# EAGLE design atmega embedded main 2 (EAGLE 8.5.0)
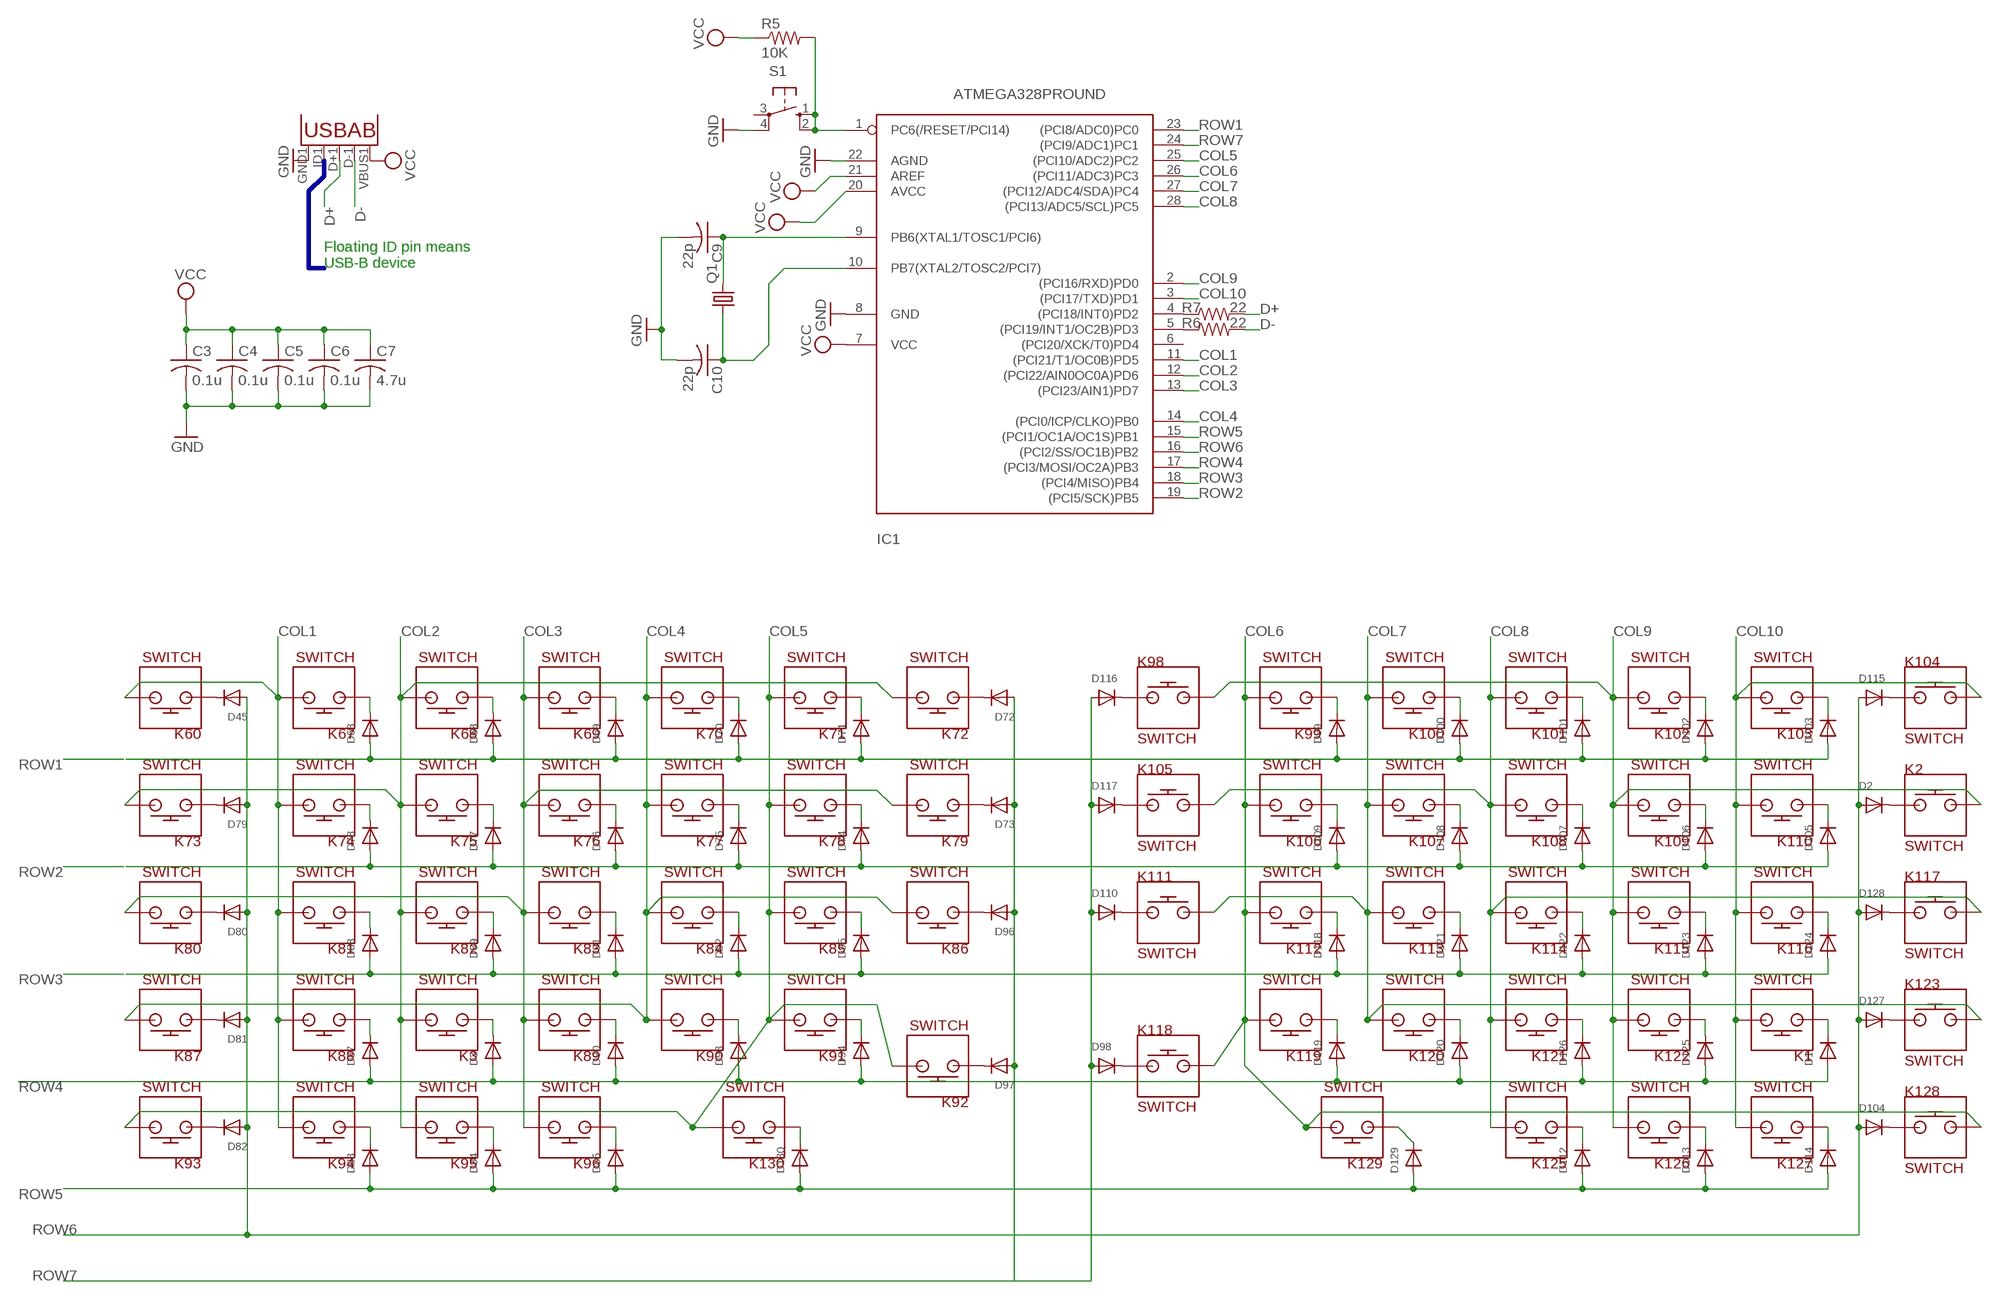
[diagram p0: schematic, sheet 1]

## Parts
C3  0.1u  C-USC0805  [C0805]
C4  0.1u  C-USC0805  [C0805]
C5  0.1u  C-USC0805  [C0805]
C6  0.1u  C-USC0805  [C0805]
C7  4.7u  C-USC0805  [C0805]
C9  22p  C-USC0805  [C0805]
C10  22p  C-USC0805  [C0805]
D1  DIODESMA  [SMADIODE]
D2  DIODESMA  [SMADIODE]
D3  DIODESMA  [SMADIODE]
D45  DIODESMA  [SMADIODE]
D63  DIODESMA  [SMADIODE]
D68  DIODESMA  [SMADIODE]
D69  DIODESMA  [SMADIODE]
D70  DIODESMA  [SMADIODE]
D71  DIODESMA  [SMADIODE]
D72  DIODESMA  [SMADIODE]
D73  DIODESMA  [SMADIODE]
D74  DIODESMA  [SMADIODE]
D75  DIODESMA  [SMADIODE]
D76  DIODESMA  [SMADIODE]
D77  DIODESMA  [SMADIODE]
D78  DIODESMA  [SMADIODE]
D79  DIODESMA  [SMADIODE]
D80  DIODESMA  [SMADIODE]
D81  DIODESMA  [SMADIODE]
D82  DIODESMA  [SMADIODE]
D83  DIODESMA  [SMADIODE]
D84  DIODESMA  [SMADIODE]
D85  DIODESMA  [SMADIODE]
D87  DIODESMA  [SMADIODE]
D88  DIODESMA  [SMADIODE]
D89  DIODESMA  [SMADIODE]
D90  DIODESMA  [SMADIODE]
D91  DIODESMA  [SMADIODE]
D92  DIODESMA  [SMADIODE]
D93  DIODESMA  [SMADIODE]
D94  DIODESMA  [SMADIODE]
D95  DIODESMA  [SMADIODE]
D96  DIODESMA  [SMADIODE]
D97  DIODESMA  [SMADIODE]
D98  DIODESMA  [SMADIODE]
D99  DIODESMA  [SMADIODE]
D100  DIODESMA  [SMADIODE]
D101  DIODESMA  [SMADIODE]
D102  DIODESMA  [SMADIODE]
D103  DIODESMA  [SMADIODE]
D104  DIODESMA  [SMADIODE]
D105  DIODESMA  [SMADIODE]
D106  DIODESMA  [SMADIODE]
D107  DIODESMA  [SMADIODE]
D108  DIODESMA  [SMADIODE]
D109  DIODESMA  [SMADIODE]
D110  DIODESMA  [SMADIODE]
D112  DIODESMA  [SMADIODE]
D113  DIODESMA  [SMADIODE]
D114  DIODESMA  [SMADIODE]
D115  DIODESMA  [SMADIODE]
D116  DIODESMA  [SMADIODE]
D117  DIODESMA  [SMADIODE]
D118  DIODESMA  [SMADIODE]
D119  DIODESMA  [SMADIODE]
D120  DIODESMA  [SMADIODE]
D121  DIODESMA  [SMADIODE]
D122  DIODESMA  [SMADIODE]
D123  DIODESMA  [SMADIODE]
D124  DIODESMA  [SMADIODE]
D125  DIODESMA  [SMADIODE]
D126  DIODESMA  [SMADIODE]
D127  DIODESMA  [SMADIODE]
D128  DIODESMA  [SMADIODE]
D129  DIODESMA  [SMADIODE]
D130  DIODESMA  [SMADIODE]
IC1  ATMEGA328PROUND  [DIL28-3-ROUND]
K1  SWITCH  [KAILH_LOW_PROFILE]
K2  SWITCH  [KAILH_LOW_PROFILE]
K3  SWITCH  [KAILH_LOW_PROFILE]
K60  SWITCH  [KAILH_LOW_PROFILE]
K67  SWITCH  [KAILH_LOW_PROFILE]
K68  SWITCH  [KAILH_LOW_PROFILE]
K69  SWITCH  [KAILH_LOW_PROFILE]
K70  SWITCH  [KAILH_LOW_PROFILE]
K71  SWITCH  [KAILH_LOW_PROFILE]
K72  SWITCH  [KAILH_LOW_PROFILE]
K73  SWITCH  [KAILH_LOW_PROFILE]
K74  SWITCH  [KAILH_LOW_PROFILE]
K75  SWITCH  [KAILH_LOW_PROFILE]
K76  SWITCH  [KAILH_LOW_PROFILE]
K77  SWITCH  [KAILH_LOW_PROFILE]
K78  SWITCH  [KAILH_LOW_PROFILE]
K79  SWITCH  [KAILH_LOW_PROFILE]
K80  SWITCH  [KAILH_LOW_PROFILE]
K81  SWITCH  [KAILH_LOW_PROFILE]
K82  SWITCH  [KAILH_LOW_PROFILE]
K83  SWITCH  [KAILH_LOW_PROFILE]
K84  SWITCH  [KAILH_LOW_PROFILE]
K85  SWITCH  [KAILH_LOW_PROFILE]
K86  SWITCH  [KAILH_LOW_PROFILE]
K87  SWITCH  [KAILH_LOW_PROFILE]
K88  SWITCH  [KAILH_LOW_PROFILE]
K89  SWITCH  [KAILH_LOW_PROFILE]
K90  SWITCH  [KAILH_LOW_PROFILE]
K91  SWITCH  [KAILH_LOW_PROFILE]
K92  SWITCH  [KAILH_LOW_PROFILE]
K93  SWITCH  [KAILH_LOW_PROFILE]
K94  SWITCH  [KAILH_LOW_PROFILE]
K95  SWITCH  [KAILH_LOW_PROFILE]
K96  SWITCH  [KAILH_LOW_PROFILE]
K98  SWITCH  [KAILH_LOW_PROFILE]
K99  SWITCH  [KAILH_LOW_PROFILE]
K100  SWITCH  [KAILH_LOW_PROFILE]
K101  SWITCH  [KAILH_LOW_PROFILE]
K102  SWITCH  [KAILH_LOW_PROFILE]
K103  SWITCH  [KAILH_LOW_PROFILE]
K104  SWITCH  [KAILH_LOW_PROFILE]
K105  SWITCH  [KAILH_LOW_PROFILE]
K106  SWITCH  [KAILH_LOW_PROFILE]
K107  SWITCH  [KAILH_LOW_PROFILE]
K108  SWITCH  [KAILH_LOW_PROFILE]
K109  SWITCH  [KAILH_LOW_PROFILE]
K110  SWITCH  [KAILH_LOW_PROFILE]
K111  SWITCH  [KAILH_LOW_PROFILE]
K112  SWITCH  [KAILH_LOW_PROFILE]
K113  SWITCH  [KAILH_LOW_PROFILE]
K114  SWITCH  [KAILH_LOW_PROFILE]
K115  SWITCH  [KAILH_LOW_PROFILE]
K116  SWITCH  [KAILH_LOW_PROFILE]
K117  SWITCH  [KAILH_LOW_PROFILE]
K118  SWITCH  [KAILH_LOW_PROFILE]
K119  SWITCH  [KAILH_LOW_PROFILE]
K120  SWITCH  [KAILH_LOW_PROFILE]
K121  SWITCH  [KAILH_LOW_PROFILE]
K122  SWITCH  [KAILH_LOW_PROFILE]
K123  SWITCH  [KAILH_LOW_PROFILE]
K125  SWITCH  [KAILH_LOW_PROFILE]
K126  SWITCH  [KAILH_LOW_PROFILE]
K127  SWITCH  [KAILH_LOW_PROFILE]
K128  SWITCH  [KAILH_LOW_PROFILE]
K129  SWITCH  [KAILH_LOW_PROFILE]
K130  SWITCH  [KAILH_LOW_PROFILE]
Q1  CRYSTALHC49S  [HC49/S]
R5  10K  R-US_M0805  [M0805]
R6  22  R-US_M0805  [M0805]
R7  22  R-US_M0805  [M0805]
S1  10-XX  [B3F-10XX]
U1  USB""  [USB-MICRO-SMD]

## Nets
COL1: IC1.11((PCI21/T1/OC0B)PD5) K60.P$2 K67.P$2 K74.P$2 K81.P$2 K88.P$2 K94.P$2
COL2: IC1.12((PCI22/AIN0OC0A)PD6) K3.P$2 K68.P$2 K72.P$2 K73.P$2 K75.P$2 K82.P$2 K95.P$2
COL3: IC1.13((PCI23/AIN1)PD7) K69.P$2 K76.P$2 K79.P$2 K80.P$2 K83.P$2 K89.P$2 K96.P$2
COL4: IC1.14((PCI0/ICP/CLKO)PB0) K70.P$2 K77.P$2 K84.P$2 K86.P$2 K87.P$2 K90.P$2
COL5: IC1.25((PCI10/ADC2)PC2) K71.P$2 K78.P$2 K85.P$2 K91.P$2 K92.P$2 K93.P$2 K130.P$2
COL6: IC1.26((PCI11/ADC3)PC3) K99.P$2 K106.P$2 K112.P$2 K118.P$2 K119.P$2 K128.P$2 K129.P$2
COL7: IC1.27((PCI12/ADC4/SDA)PC4) K100.P$2 K107.P$2 K111.P$2 K113.P$2 K120.P$2 K123.P$2
COL8: IC1.28((PCI13/ADC5/SCL)PC5) K101.P$2 K105.P$2 K108.P$2 K114.P$2 K117.P$2 K121.P$2 K125.P$2
COL9: IC1.2((PCI16/RXD)PD0) K2.P$2 K98.P$2 K102.P$2 K109.P$2 K115.P$2 K122.P$2 K126.P$2
COL10: IC1.3((PCI17/TXD)PD1) K1.P$2 K103.P$2 K104.P$2 K110.P$2 K116.P$2 K127.P$2
D+: R7.2 U1.D+1(D+)
D-: R6.2 U1.D-1(D-)
GND: C3.2 C4.2 C5.2 C6.2 C7.2 C9.2 C10.2 IC1.8(GND) IC1.22(AGND) S1.4(P1) U1.GND1(GND)
N$1: D45.C K60.P$1
N$2: D79.C K73.P$1
N$3: D80.C K80.P$1
N$4: D81.C K87.P$1
N$5: D82.C K93.P$1
N$6: D63.C K67.P$1
N$7: D88.C K81.P$1
N$8: D78.C K74.P$1
N$9: D83.C K94.P$1
N$10: D77.C K75.P$1
N$11: D89.C K82.P$1
N$12: D68.C K68.P$1
N$13: D84.C K95.P$1
N$14: D76.C K76.P$1
N$15: IC1.1(PC6(/RESET/PCI14)) R5.2 S1.1(S) S1.2(S1)
N$16: C9.1 IC1.9(PB6(XTAL1/TOSC1/PCI6)) Q1.2
N$17: C10.1 IC1.10(PB7(XTAL2/TOSC2/PCI7)) Q1.1
N$18: D69.C K69.P$1
N$19: D90.C K89.P$1
N$20: D85.C K96.P$1
N$21: IC1.4((PCI18/INT0)PD2) R7.1
N$22: D91.C K83.P$1
N$23: D3.C K3.P$1
N$24: D70.C K70.P$1
N$25: D75.C K77.P$1
N$26: D129.C K129.P$1
N$27: D116.C K98.P$1
N$28: D117.C K105.P$1
N$29: D92.C K84.P$1
N$30: D93.C K90.P$1
N$31: D94.C K91.P$1
N$32: D71.C K71.P$1
N$33: D74.C K78.P$1
N$34: D95.C K85.P$1
N$35: D130.C K130.P$1
N$36: D72.C K72.P$1
N$37: D73.C K79.P$1
N$38: D96.C K86.P$1
N$39: D97.C K92.P$1
N$40: D110.C K111.P$1
N$41: D98.C K118.P$1
N$42: D115.C K104.P$1
N$43: D119.C K119.P$1
N$44: D99.C K99.P$1
N$45: D109.C K106.P$1
N$46: D118.C K112.P$1
N$47: D2.C K2.P$1
N$48: D100.C K100.P$1
N$49: D108.C K107.P$1
N$50: D121.C K113.P$1
N$51: D120.C K120.P$1
N$52: D126.C K121.P$1
N$53: D101.C K101.P$1
N$54: D107.C K108.P$1
N$55: D122.C K114.P$1
N$56: D112.C K125.P$1
N$57: D123.C K115.P$1
N$58: D106.C K109.P$1
N$59: D102.C K102.P$1
N$60: D113.C K126.P$1
N$61: D124.C K116.P$1
N$62: D105.C K110.P$1
N$63: D103.C K103.P$1
N$64: D114.C K127.P$1
N$65: D128.C K117.P$1
N$66: D127.C K123.P$1
N$67: D104.C K128.P$1
N$68: IC1.5((PCI19/INT1/OC2B)PD3) R6.1
N$69: D1.C K1.P$1
N$80: D87.C K88.P$1
N$142: D125.C K122.P$1
ROW1: D63.A D68.A D69.A D70.A D71.A D99.A D100.A D101.A D102.A D103.A IC1.23((PCI8/ADC0)PC0)
ROW2: D74.A D75.A D76.A D77.A D78.A D105.A D106.A D107.A D108.A D109.A IC1.19((PCI5/SCK)PB5)
ROW3: D88.A D89.A D91.A D92.A D95.A D118.A D121.A D122.A D123.A D124.A IC1.18((PCI4/MISO)PB4)
ROW4: D1.A D3.A D87.A D90.A D93.A D94.A D119.A D120.A D125.A D126.A IC1.17((PCI3/MOSI/OC2A)PB3)
ROW5: D83.A D84.A D85.A D112.A D113.A D114.A D129.A D130.A IC1.15((PCI1/OC1A/OC1S)PB1)
ROW6: D2.A D45.A D79.A D80.A D81.A D82.A D104.A D115.A D127.A D128.A IC1.16((PCI2/SS/OC1B)PB2)
ROW7: D72.A D73.A D96.A D97.A D98.A D110.A D116.A D117.A IC1.24((PCI9/ADC1)PC1)
VCC: C3.1 C4.1 C5.1 C6.1 C7.1 IC1.7(VCC) IC1.20(AVCC) IC1.21(AREF) R5.1 U1.VBUS1(VBUS)
Unconnected: IC1.6((PCI20/XCK/T0)PD4) S1.3(P) U1.ID1(USBID)

## Buses
B$1

## Notes on the sheet
- Floating ID pin means
  USB-B device

## Library data of the parts
C3-C7 C9 C10 = adafruit:C-US: CAPACITOR, American symbol
D1-D3 D45 D63 D68-D85 D87-D110 D112-D130 = adafruit:DIODE: Diode SMADIODE - SMA Surface Mount Package 20V 1A Schottky Diode Digikey: 641-1014-6-ND DO-1N4148 - Through Hole Small Current Diode SOD-123 20V 1 A (.5mV Vf) Schottky Diode - Digikey: MBRX120TPMSCT-ND SOD-323 10V 570mA (.38mV Vf, 3ns) Schottky Diode - Digikey: ZLLS410CT-ND SOD-523 30V 30mA Schottky Diode (RB751S-40TE61) - Digikey: RB751S-40TE61CT-ND SOT23-R/W - SOT23 Package (R = Solder Paste/Reflow Ovens, W = Hand-Soldering) BAT54Film 40V 300mA - Digikey: 497-7162-1-ND
IC1 = atmega328:ATMEGA328*P: MICROCONTROLLER 32 kBytes FLASH 2 kBytes SRAM 1 kBytes EEPROM USART 8-channel 10 bit ADC
K1-K3 K60 K67-K96 K98-K123 K125-K130 = keyboard_switch:SWITCH
Q1 = crystal:CRYSTAL: CRYSTAL; OC_FARNELL: 1667008; OC_NEWARK: unknown
R5-R7 = adafruit:R-US_: RESISTOR, American symbol
S1 = switch-omron:10-XX: OMRON SWITCH; MPN: B3F-1000; OC_FARNELL: 176432; OC_NEWARK: 36M3542
U1 = microusb:USB: This is a USB AB connector that is compatible with USB OTG. i.e. this connector can serve as a host or device

## Board
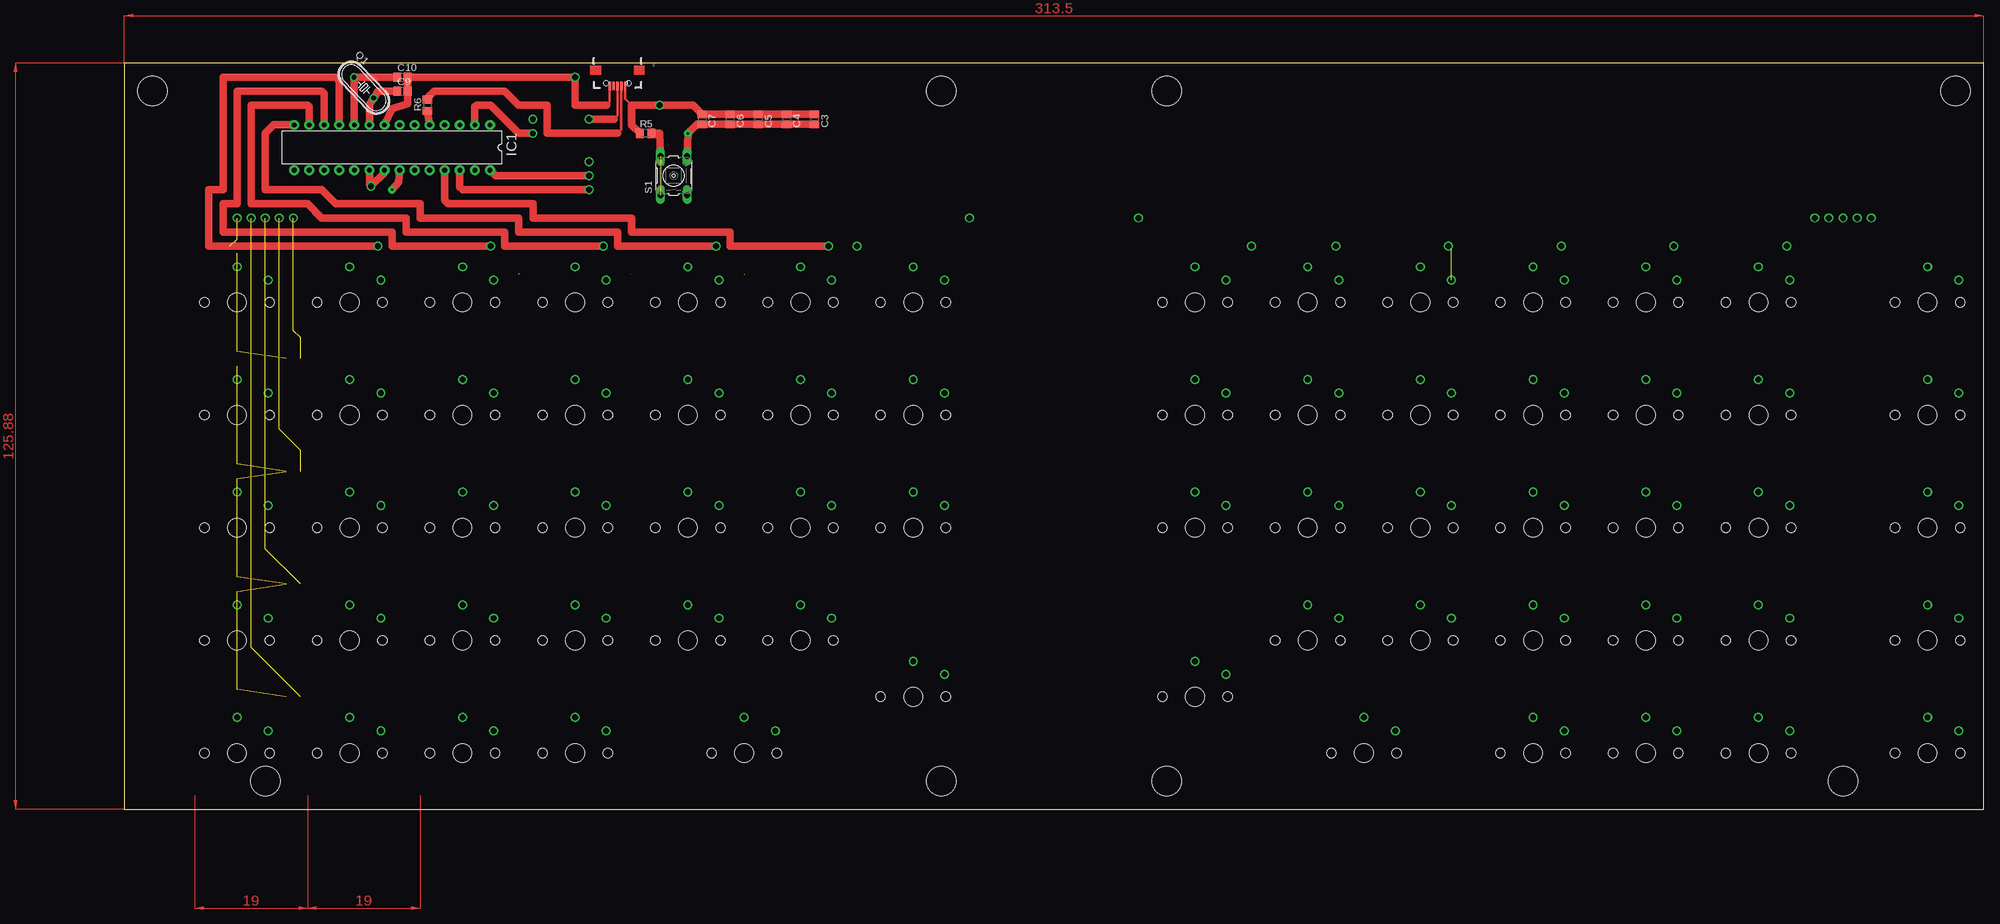
[diagram p1: board, top side]
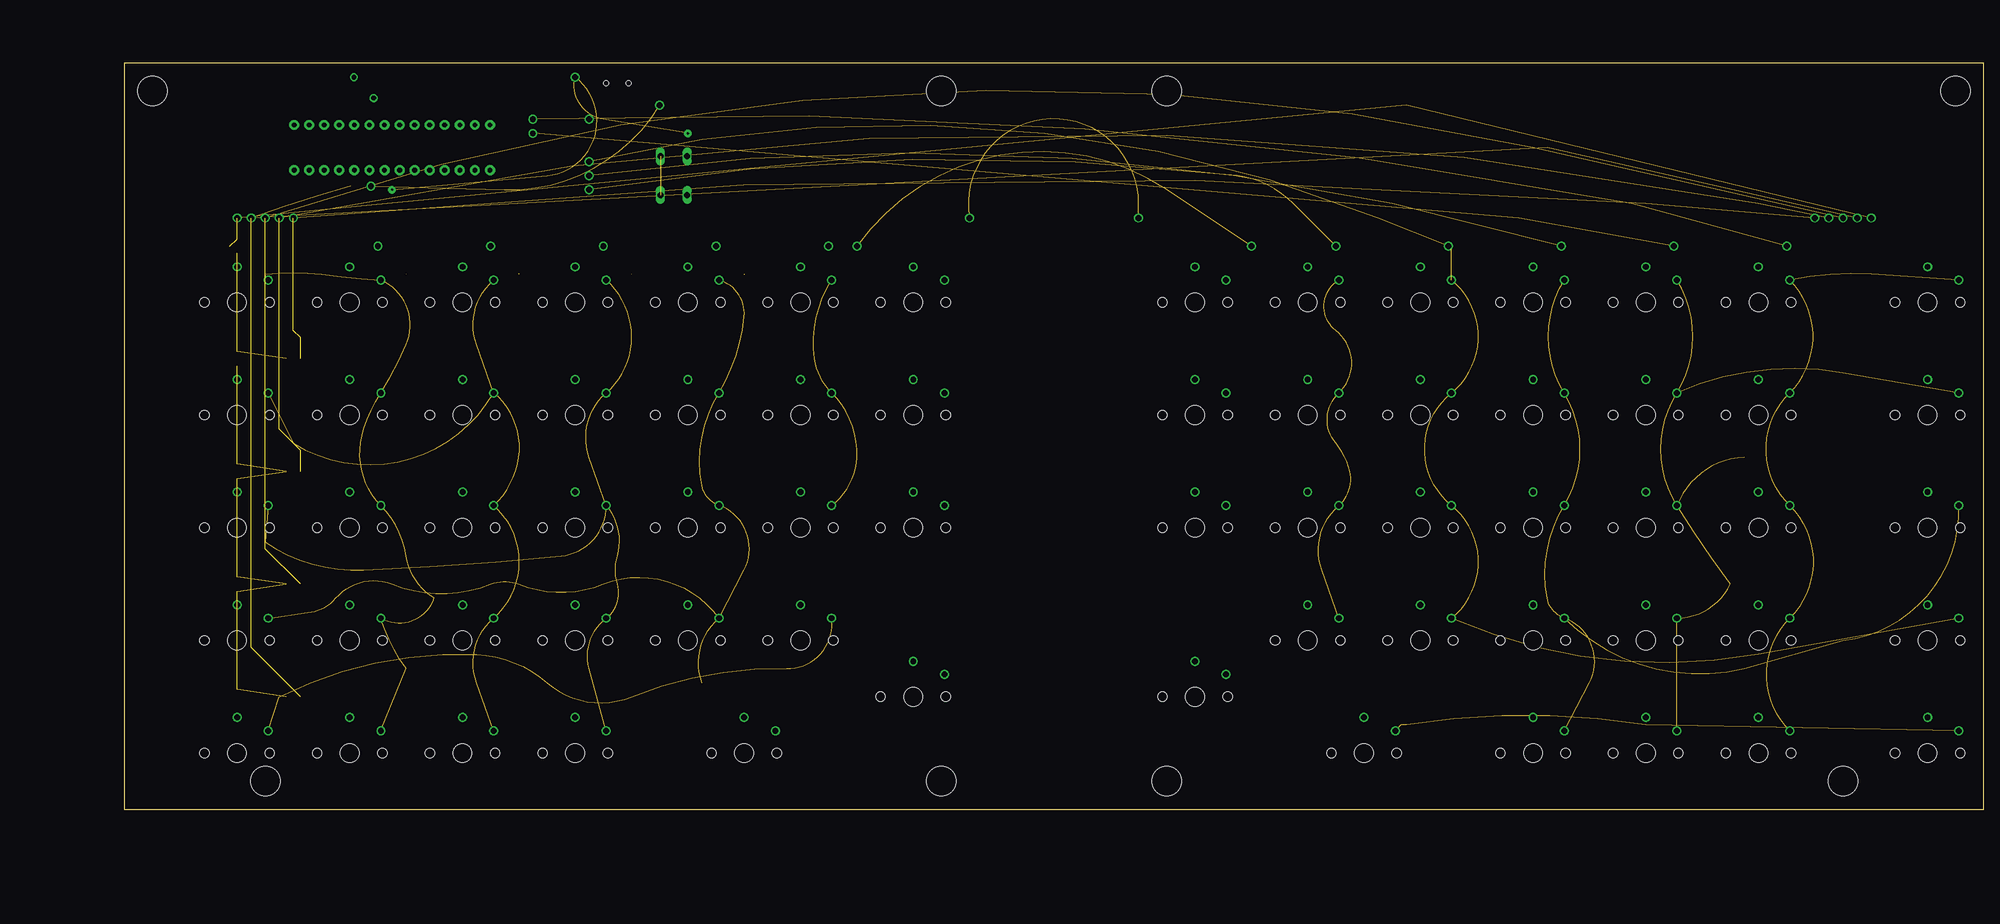
[diagram p2: board, inner layer Route7]
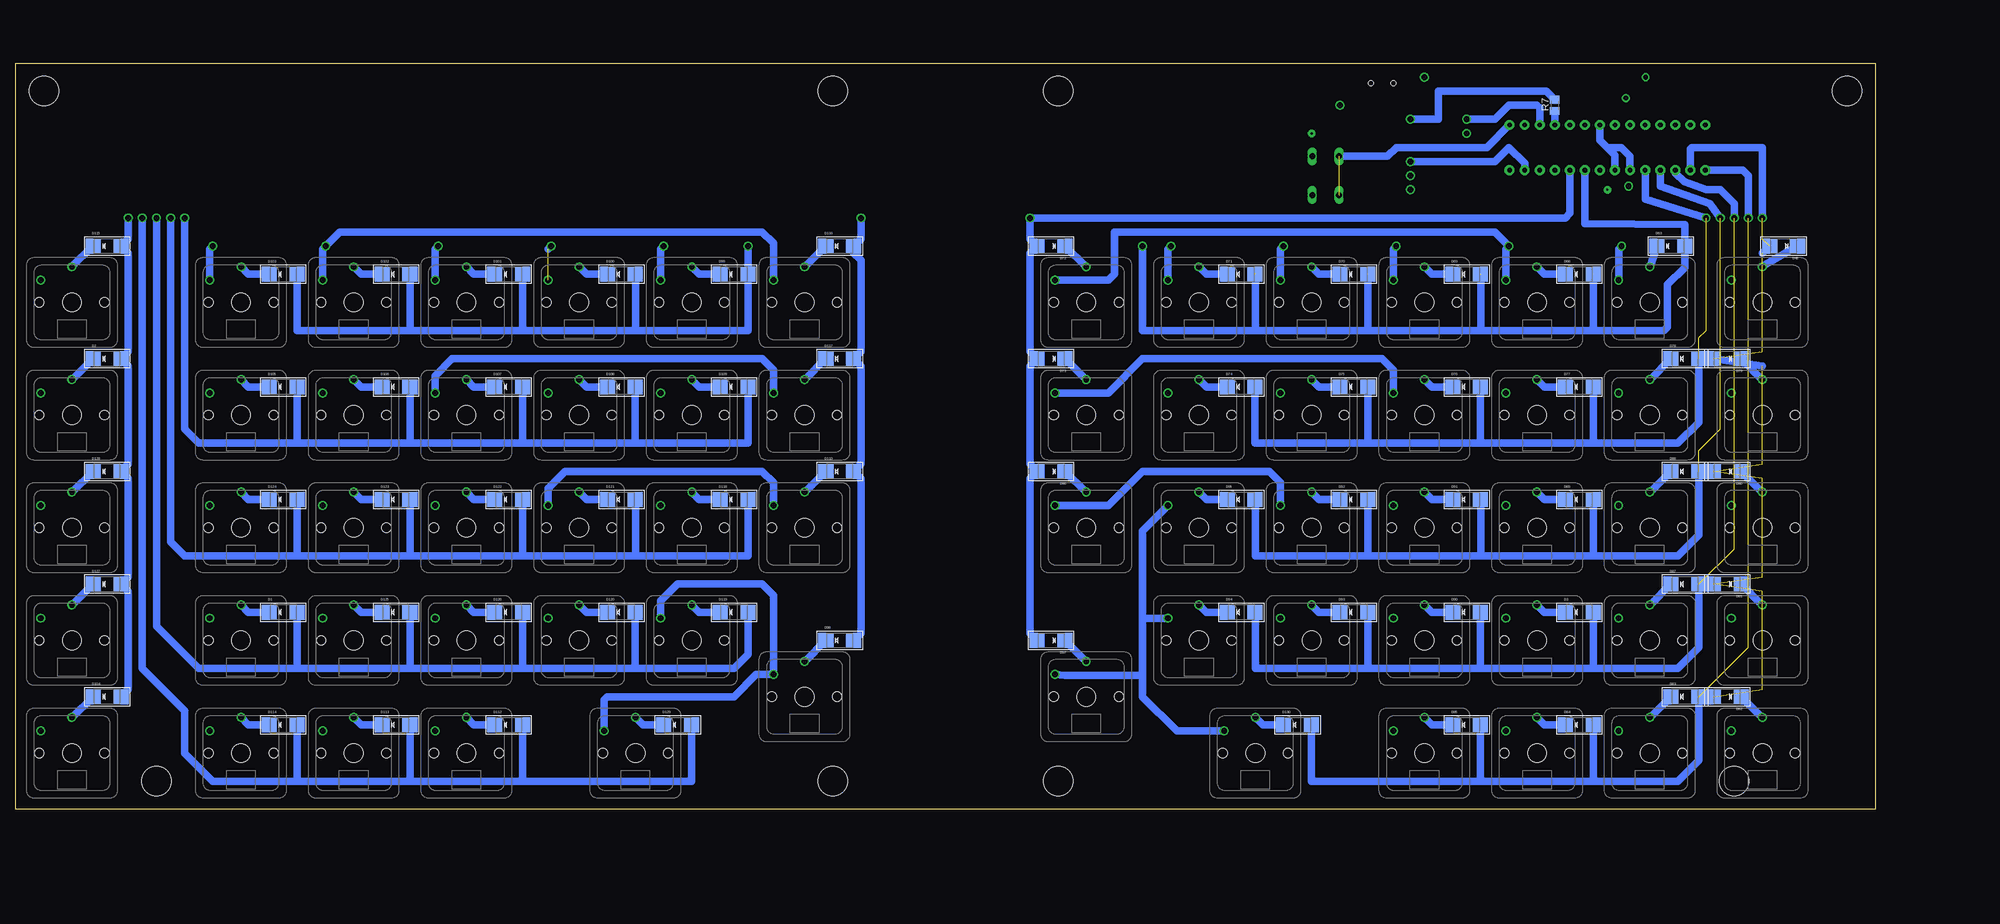
[diagram p3: board, bottom side, seen from below]

Size 313.5 x 125.88 mm. Coordinates in mm from the lower left corner, seen from the top.
Outline: 0,0 313.5,0 313.5,125.88 0,125.88 0,0
Copper layers (1*16): Top 0.035mm / dielectric 1.5mm / Bottom 0.035mm
Design rules "default": minimum track width 6mil, minimum drill 0.35mm, track to track 6mil, track to pad 6mil, pad to pad 6mil, via to via 6mil, smd to smd 6mil, copper to edge 40mil, drill to drill 6mil, minimum pad ring 10mil, minimum via ring 8mil, stop-mask expansion 4mil, vias tented up to drill 0mil, thermal gap 10mil
Holes 5 mm at 23.75,4.75 289.75,4.75 137.75,4.75 175.75,4.75 137.75,121.12 4.75,121.12 175.75,121.12 308.75,121.12

### Footprints (pad centres in the part's own frame; a part is rotated, then mirrored left to right if it is on the bottom)
C0805 = smd 1.3 x 1.5: 1 -0.85,0; 2 0.85,0
SMADIODE = smd 2.54 x 2.54: A 2.349,0; C -2.349,0
DIL28-3-ROUND = drill 0.813 pad 1.676: 1 -16.51,-3.81; 2 -13.97,-3.81; 3 -11.43,-3.81; 4 -8.89,-3.81; 5 -6.35,-3.81; 6 -3.81,-3.81; 7 -1.27,-3.81; 8 1.27,-3.81; 9 3.81,-3.81; 10 6.35,-3.81; 11 8.89,-3.81; 12 11.43,-3.81; 13 13.97,-3.81; 14 16.51,-3.81; 15 16.51,3.81; 16 13.97,3.81; 17 11.43,3.81; 18 8.89,3.81; 19 6.35,3.81; 20 3.81,3.81; 21 1.27,3.81; 22 -1.27,3.81; 23 -3.81,3.81; 24 -6.35,3.81; 25 -8.89,3.81; 26 -11.43,3.81; 27 -13.97,3.81; 28 -16.51,3.81
KAILH_LOW_PROFILE = drill 1: P$1 0,6; P$2 -5.25,3.75 | hole 1.6: -5.5,0; 5.5,0 | hole 3.2: 0,0
HC49/S = drill 0.813: 1 -2.413,0; 2 2.413,0
M0805 = smd 1.3 x 1.6: 1 -0.95,0; 2 0.95,0
B3F-10XX = drill 1.016 long: 1 -3.251,2.261; 2 3.251,2.261; 3 -3.251,-2.261; 4 3.251,-2.261
USB-MICRO-SMD = smd 1.4 x 0.4: D+1 2.7,0; D-1 2.7,0.65; GND1 2.7,-1.3; ID1 2.7,-0.65; VBUS1 2.7,1.3 | hole 0.85: 2.2,1.9; 2.2,-1.9

### Placement (x,y rotation side)
C3  116.38,116.38 270 top
C4  111.62,116.38 270 top
C5  106.88,116.38 270 top
C6  102.12,116.38 270 top
C7  97.38,116.38 270 top
C9  46.91,121.12 0 top
C10  46.91,123.5 0 top
D1  268.38,33.25 0 bottom
D2  298.06,76 0 bottom
D3  49.88,33.25 0 bottom
D45  15.44,95 180 bottom
D63  34.44,95 0 bottom
D68  49.88,90.25 0 bottom
D69  68.88,90.25 0 bottom
D70  87.88,90.25 0 bottom
D71  106.88,90.25 0 bottom
D72  138.94,95 180 bottom
D73  138.94,76 180 bottom
D74  106.88,71.25 0 bottom
D75  87.88,71.25 0 bottom
D76  68.88,71.25 0 bottom
D77  49.88,71.25 0 bottom
D78  32.06,76 0 bottom
D79  24.94,76 180 bottom
D80  24.94,57 180 bottom
D81  24.94,38 180 bottom
D82  24.94,19 180 bottom
D83  32.06,19 0 bottom
D84  49.88,14.25 0 bottom
D85  68.88,14.25 0 bottom
D87  32.06,38 0 bottom
D88  32.06,57 0 bottom
D89  49.88,52.25 0 bottom
D90  68.88,33.25 0 bottom
D91  68.88,52.25 0 bottom
D92  87.88,52.25 0 bottom
D93  87.88,33.25 0 bottom
D94  106.88,33.25 0 bottom
D95  106.88,52.25 0 bottom
D96  138.94,57 180 bottom
D97  138.94,28.5 180 bottom
D98  174.56,28.5 0 bottom
D99  192.38,90.25 0 bottom
D100  211.38,90.25 0 bottom
D101  230.38,90.25 0 bottom
D102  249.38,90.25 0 bottom
D103  268.38,90.25 0 bottom
D104  298.06,19 0 bottom
D105  268.38,71.25 0 bottom
D106  249.38,71.25 0 bottom
D107  230.38,71.25 0 bottom
D108  211.38,71.25 0 bottom
D109  192.38,71.25 0 bottom
D110  174.56,57 0 bottom
D112  230.38,14.25 0 bottom
D113  249.38,14.25 0 bottom
D114  268.38,14.25 0 bottom
D115  298.06,95 0 bottom
D116  174.56,95 0 bottom
D117  174.56,76 0 bottom
D118  192.38,52.25 0 bottom
D119  192.38,33.25 0 bottom
D120  211.38,33.25 0 bottom
D121  211.38,52.25 0 bottom
D122  230.38,52.25 0 bottom
D123  249.38,52.25 0 bottom
D124  268.38,52.25 0 bottom
D125  249.38,33.25 0 bottom
D126  230.38,33.25 0 bottom
D127  298.06,38 0 bottom
D128  298.06,57 0 bottom
D129  201.88,14.25 0 bottom
D130  97.38,14.25 0 bottom
IC1  45.12,111.62 180 top
K1  275.5,28.5 0 bottom
K2  304,66.5 0 bottom
K3  57,28.5 0 bottom
K60  19,85.5 0 bottom
K67  38,85.5 0 bottom
K68  57,85.5 0 bottom
K69  76,85.5 0 bottom
K70  95,85.5 0 bottom
K71  114,85.5 0 bottom
K72  133,85.5 0 bottom
K73  19,66.5 0 bottom
K74  38,66.5 0 bottom
K75  57,66.5 0 bottom
K76  76,66.5 0 bottom
K77  95,66.5 0 bottom
K78  114,66.5 0 bottom
K79  133,66.5 0 bottom
K80  19,47.5 0 bottom
K81  38,47.5 0 bottom
K82  57,47.5 0 bottom
K83  76,47.5 0 bottom
K84  95,47.5 0 bottom
K85  114,47.5 0 bottom
K86  133,47.5 0 bottom
K87  19,28.5 0 bottom
K88  38,28.5 0 bottom
K89  76,28.5 0 bottom
K90  95,28.5 0 bottom
K91  114,28.5 0 bottom
K92  133,19 0 bottom
K93  19,9.5 0 bottom
K94  38,9.5 0 bottom
K95  57,9.5 0 bottom
K96  76,9.5 0 bottom
K98  180.5,85.5 0 bottom
K99  199.5,85.5 0 bottom
K100  218.5,85.5 0 bottom
K101  237.5,85.5 0 bottom
K102  256.5,85.5 0 bottom
K103  275.5,85.5 0 bottom
K104  304,85.5 0 bottom
K105  180.5,66.5 0 bottom
K106  199.5,66.5 0 bottom
K107  218.5,66.5 0 bottom
K108  237.5,66.5 0 bottom
K109  256.5,66.5 0 bottom
K110  275.5,66.5 0 bottom
K111  180.5,47.5 0 bottom
K112  199.5,47.5 0 bottom
K113  218.5,47.5 0 bottom
K114  237.5,47.5 0 bottom
K115  256.5,47.5 0 bottom
K116  275.5,47.5 0 bottom
K117  304,47.5 0 bottom
K118  180.5,19 0 bottom
K119  199.5,28.5 0 bottom
K120  218.5,28.5 0 bottom
K121  237.5,28.5 0 bottom
K122  256.5,28.5 0 bottom
K123  304,28.5 0 bottom
K125  237.5,9.5 0 bottom
K126  256.5,9.5 0 bottom
K127  275.5,9.5 0 bottom
K128  304,9.5 0 bottom
K129  209,9.5 0 bottom
K130  104.5,9.5 0 bottom
Q1  40.38,121.72 313.5 top
R5  87.88,114 0 top
R6  51.06,118.75 90 top
R7  54.03,118.75 90 bottom
S1  92.62,106.88 90 top
U1  83.12,124.69 270 top

### Tracks (layer width: path | path; a pad name or v marks a point on that pad's centre or on a via)
COL1  (via drill 1)
  Top 1.27: IC1.11 36.23,122.89 35.62,123.5 16.62,123.5 16.62,104.5 14.25,104.5 14.25,95 v42.75,95
  Route7 0.076: K60.P$2 23.75,90.25 arc-13 33.25,90.25 arc1 K67.P$2 arc-90 47.5,78.38 arc-8 K74.P$2 arc13 40.38,64.12 arc63 K81.P$2 arc-35 47.5,42.75 arc49 52.25,35.62 arc-100 K88.P$2 arc19 47.5,23.75 K94.P$2
  Bottom 1.27: K67.P$2 43.25,94.5 v42.75,95
COL2  (via drill 1)
  Top 1.27: v61.75,95 45.12,95 45.12,97.38 16.62,97.38 16.62,102.12 19,102.12 19,121.12 33.25,121.12 33.7,120.68 IC1.12
  Route7 0.076: K73.P$2 28.5,61.75 arc92 K75.P$2 | K75.P$2 arc-59 66.5,59.38 arc-39 K82.P$2 arc-98 K3.P$2 arc69 59.38,21.38 K95.P$2 | K75.P$2 59.38,78.38 arc-69 K68.P$2
  Bottom 1.27: K68.P$2 62.25,94.5 v61.75,95 64.12,97.38 128.25,97.38 128.25,90.25 129.25,89.25 K72.P$2
COL3  (via drill 1)
  Top 1.27: v80.75,95 64.12,95 64.12,97.38 47.5,97.38 47.5,99.75 33.25,99.75 30.88,102.12 21.38,102.12 21.38,118.75 30.88,118.75 31.16,118.47 IC1.13
  Route7 0.076: K80.P$2 23.75,45.12 arc37 40.38,40.38 arc3 73.62,42.75 arc85 K83.P$2 | K96.P$2 78.38,23.75 arc-68 K89.P$2 arc69 83.12,38 arc-33 83.12,42.75 arc58 K83.P$2 | K83.P$2 78.38,59.38 arc-69 K76.P$2 arc54 85.5,80.75 arc43 K69.P$2
  Bottom 1.27: K69.P$2 81.25,94.5 v80.75,95 | K79.P$2 129.25,70.25 123.5,76 83.12,76 81.25,74.12 K76.P$2
COL4  (via drill 1)
  Top 1.27: v99.75,95 83.12,95 83.12,97.38 66.5,97.38 66.5,99.75 49.88,99.75 49.88,102.12 35.62,102.12 33.25,104.5 23.75,104.5 23.75,114 25.19,115.44 IC1.14
  Route7 0.076: K87.P$2 30.88,33.25 arc46 35.62,35.62 arc-71 45.12,38 arc43 61.75,38 arc-43 66.5,38 arc43 80.75,38 arc-76 K90.P$2 | 97.38,21.38 arc-69 K90.P$2 | K90.P$2 104.5,40.38 arc98 K84.P$2 arc-60 97.38,54.62 arc-42 K77.P$2 arc26 104.5,83.12 arc80 K70.P$2
  Bottom 1.27: K70.P$2 100.25,94.5 v99.75,95 | K86.P$2 129.25,51.25 123.5,57 102.12,57 100.25,55.12 K84.P$2
COL5  (via drill 1)
  Top 1.27: v118.75,95 102.12,95 102.12,97.38 85.5,97.38 85.5,99.75 68.88,99.75 68.88,102.12 54.62,102.12 54.02,102.73 IC1.25
  Route7 0.076: K93.P$2 26.12,19 arc-29 59.38,26.12 arc-38 71.25,21.38 arc63 85.5,19 arc-23 111.62,23.75 arc99 K91.P$2 | K85.P$2 arc50 123.5,59.38 arc48 K78.P$2 arc-37 116.38,76 arc-40 K71.P$2
  Bottom 1.27: K71.P$2 119.25,94.5 v118.75,95 | 123.5,22.56 123.5,19 117.75,13.25 K130.P$2 | 123.5,22.56 123.5,32.25 | 123.5,32.25 K91.P$2 | 123.5,32.25 123.5,47 K85.P$2 | K92.P$2 136.56,22.56 123.5,22.56
COL6  (via drill 1)
  Top 1.27: v78.38,104.5 57,104.5 56.55,104.94 IC1.26
  Route7 0.076: K119.P$2 201.88,40.38 arc-69 K112.P$2 arc62 206.62,57 arc27 204.25,61.75 arc-87 K106.P$2 arc99 204.25,80.75 arc-111 K99.P$2 | v204.25,95 197.12,102.12 arc37 187.62,106.88 arc16 v78.38,104.5 | K128.P$2 256.5,14.25 arc18 216.12,14.25 215.25,14.25 K129.P$2
  Bottom 1.27: K99.P$2 204.75,94.5 v204.25,95 | K119.P$2 204.75,35.12 201.88,38 187.62,38 185.75,36.12 K118.P$2 188.62,22.75 192.38,19 213.75,19 214.25,18.5 K129.P$2
COL7  (via drill 1)  (1 unrouted)
  Route7 0.076: v223.25,95 211.38,99.75 arc35 v78.38,109.25 | K100.P$2 arc-102 K107.P$2 arc102 K113.P$2 arc-102 K120.P$2 arc34 275.5,26.12 K123.P$2
  Bottom 1.27: 223.75,94.5 v223.25,95 | v78.38,109.25 64.12,109.25 61.75,111.62 59.09,108.97 IC1.27 | K111.P$2 185.75,55.12 187.62,57 220.88,57 223.75,54.12 K113.P$2
COL8  (via drill 1)
  Top 1.27: v78.38,106.88 62.58,106.88 IC1.28
  Route7 0.076: K125.P$2 247,21.38 arc98 K121.P$2 | K121.P$2 arc-60 239.88,35.62 arc-42 K114.P$2 arc63 K108.P$2 arc-63 K101.P$2 | K121.P$2 arc58 273.12,23.75 289.75,28.5 arc86 K117.P$2 | v242.25,95 213.75,102.12 arc20 v78.38,106.88
  Bottom 1.27: K101.P$2 242.75,94.5 v242.25,95 | K105.P$2 185.75,74.12 187.62,76 239.88,76 242.75,73.12 K108.P$2
COL9  (via drill 1)
  Top 1.27: IC1.2 59.09,118.47 59.38,118.75 61.75,118.75 66.5,114 v68.88,114
  Route7 0.076: K126.P$2 K122.P$2 arc63 270.75,38 arc-5 K115.P$2 | K115.P$2 arc-64 K109.P$2 | K109.P$2 arc64 K102.P$2 | 273.12,59.38 arc67 K115.P$2 | v261.25,95 235.12,99.75 v68.88,114 | K2.P$2 289.75,73.62 arc33 K109.P$2
  Bottom 1.27: K102.P$2 261.75,94.5 v261.25,95 258.88,97.38 187.62,97.38 185.75,95.5 K98.P$2
COL10  (via drill 1)
  Route7 0.076: K104.P$2 294.5,90.25 arc16 K103.P$2 arc-91 K110.P$2 arc91 K116.P$2 arc-91 K1.P$2 arc91 K127.P$2 | v280.25,95 254.12,102.12 arc14 v68.88,116.38
  Bottom 1.27: K103.P$2 280.75,94.5 v280.25,95 | IC1.3 56.55,118.31 57,118.75 61.75,118.75 64.12,116.38 v68.88,116.38
D+  (via drill 1)
  Top 0.406: U1.D+1 83.12,116.97 82.53,116.38
  Top 1.27: 82.53,116.38 v78.38,116.38
  Bottom 1.27: R7.2 55.46,121.12 73.62,121.12 73.62,116.38 v78.38,116.38
D-
  Top 0.406: U1.D-1 83.78,114.65 83.12,114
  Top 1.27: R6.2 51.06,119.94 52.25,121.12 64.12,121.12 66.5,118.75 71.25,118.75 71.25,114 83.12,114
GND  (via drill 0.35 pad 1.3, 1)
  Top 0.406: U1.GND1 81.83,119.23 81.34,118.75
  Top 1.27: C3.2 C4.2 C5.2 C6.2 C7.2 96.53,115.53 v95,114 S1.4 | IC1.22 46.23,105.77 v45.12,104.5 | IC1.8 45.12,118.16 47.76,119.01 C9.2 C10.2 v76,123.5 76,118.75 81.34,118.75
  Route7 0.076: v95,114 80.75,116.38 arc-94 v76,123.5 arc-138 71.25,106.88 v45.12,104.5
N$1
  Bottom 1.27: D45.C 19.09,91.5 K60.P$1
N$2
  Bottom 1.27: D79.C 19.09,72.5 K73.P$1
N$3
  Bottom 1.27: D80.C 19.09,53.5 K80.P$1
N$4
  Bottom 1.27: D81.C 19.09,34.5 K87.P$1
N$5
  Bottom 1.27: D82.C 19.09,15.5 K93.P$1
N$6
  Bottom 1.27: D63.C 37.91,91.5 K67.P$1
N$7
  Bottom 1.27: D88.C 37.91,53.5 K81.P$1
N$8
  Bottom 1.27: D78.C 37.91,72.5 K74.P$1
N$9
  Bottom 1.27: D83.C 37.91,15.5 K94.P$1
N$10
  Bottom 1.27: D77.C 55.75,71.25 K75.P$1
N$11
  Bottom 1.27: D89.C 55.75,52.25 K82.P$1
N$12
  Bottom 1.27: D68.C 55.75,90.25 K68.P$1
N$13
  Bottom 1.27: D84.C 55.75,14.25 K95.P$1
N$14
  Bottom 1.27: D76.C 74.75,71.25 K76.P$1
N$15  (1 unrouted)
  Top 1.27: S1.2 90.25,114 R5.2
  Bottom 1.27: S1.2 82.25,110.13 80.75,111.62 65.44,111.62 IC1.1
N$16
  Top 1.27: IC1.9 41.31,118.96 Q1.2 42.75,121.12 C9.1
N$17
  Top 1.27: IC1.10 38.77,122.53 Q1.1 42.75,123.5 C10.1
N$18
  Bottom 1.27: D69.C 74.75,90.25 K69.P$1
N$19
  Bottom 1.27: D90.C 74.75,33.25 K89.P$1
N$20
  Bottom 1.27: D85.C 74.75,14.25 K96.P$1
N$21
  Bottom 1.27: IC1.4 54.02,117.78 R7.1
N$22
  Bottom 1.27: D91.C 74.75,52.25 K83.P$1
N$23
  Bottom 1.27: D3.C 55.75,33.25 K3.P$1
N$24
  Bottom 1.27: D70.C 93.75,90.25 K70.P$1
N$25
  Bottom 1.27: D75.C 93.75,71.25 K77.P$1
N$26
  Bottom 1.27: D129.C 207.75,14.25 K129.P$1
N$27
  Bottom 1.27: D116.C 180.41,91.5 K98.P$1
N$28
  Bottom 1.27: D117.C 180.41,72.5 K105.P$1
N$29
  Bottom 1.27: D92.C 93.75,52.25 K84.P$1
N$30
  Bottom 1.27: D93.C 93.75,33.25 K90.P$1
N$31
  Bottom 1.27: D94.C 112.75,33.25 K91.P$1
N$32
  Bottom 1.27: D71.C 112.75,90.25 K71.P$1
N$33
  Bottom 1.27: D74.C 112.75,71.25 K78.P$1
N$34
  Bottom 1.27: D95.C 112.75,52.25 K85.P$1
N$35
  Bottom 1.27: D130.C 103.25,14.25 K130.P$1
N$36
  Bottom 1.27: D72.C 133.09,91.5 K72.P$1
N$37
  Bottom 1.27: D73.C 133.09,72.5 K79.P$1
N$38
  Bottom 1.27: D96.C 133.09,53.5 K86.P$1
N$39
  Bottom 1.27: D97.C 133.09,25 K92.P$1
N$40
  Bottom 1.27: D110.C 180.41,53.5 K111.P$1
N$41
  Bottom 1.27: D98.C 180.41,25 K118.P$1
N$42
  Bottom 1.27: D115.C 300.5,95 K104.P$1
N$43
  Bottom 1.27: D119.C 198.25,33.25 K119.P$1
N$44
  Bottom 1.27: D99.C 198.25,90.25 K99.P$1
N$45
  Bottom 1.27: D109.C 198.25,71.25 K106.P$1
N$46
  Bottom 1.27: D118.C 198.25,52.25 K112.P$1
N$47
  Bottom 1.27: D2.C 303.91,72.5 K2.P$1
N$48
  Bottom 1.27: D100.C 217.25,90.25 K100.P$1
N$49
  Bottom 1.27: D108.C 217.25,71.25 K107.P$1
N$50
  Bottom 1.27: D121.C 217.25,52.25 K113.P$1
N$51
  Bottom 1.27: D120.C 217.25,33.25 K120.P$1
N$52
  Bottom 1.27: D126.C 236.25,33.25 K121.P$1
N$53
  Bottom 1.27: D101.C 236.25,90.25 K101.P$1
N$54
  Bottom 1.27: D107.C 236.25,71.25 K108.P$1
N$55
  Bottom 1.27: D122.C 236.25,52.25 K114.P$1
N$56
  Bottom 1.27: D112.C 236.25,14.25 K125.P$1
N$57
  Bottom 1.27: D123.C 255.25,52.25 K115.P$1
N$58
  Bottom 1.27: D106.C 255.25,71.25 K109.P$1
N$59
  Bottom 1.27: D102.C 255.25,90.25 K102.P$1
N$60
  Bottom 1.27: D113.C 255.25,14.25 K126.P$1
N$61
  Bottom 1.27: D124.C 274.25,52.25 K116.P$1
N$62
  Bottom 1.27: D105.C 274.25,71.25 K110.P$1
N$63
  Bottom 1.27: D103.C 274.25,90.25 K103.P$1
N$64
  Bottom 1.27: D114.C 274.25,14.25 K127.P$1
N$65
  Bottom 1.27: D128.C 303.91,53.5 K117.P$1
N$66
  Bottom 1.27: D127.C 303.91,34.5 K123.P$1
N$67
  Bottom 1.27: D104.C 303.91,15.5 K128.P$1
N$68
  Top 1.27: IC1.5 R6.1
N$69
  Bottom 1.27: D1.C 274.25,33.25 K1.P$1
N$80
  Bottom 1.27: D87.C 37.91,34.5 K88.P$1
N$142
  Bottom 1.27: D125.C 255.25,33.25 K122.P$1
ROW1  (via drill 1)  (4 unrouted)
  Route7 0.076: v190,95 175.75,104.5 arc88 v123.5,95
  Bottom 1.27: 47.5,80.75 35.62,80.75 35.03,81.34 35.03,88.47 32.09,91.41 D63.A 32.09,98.59 48.94,98.81 IC1.23 | 47.5,80.75 47.5,90.25 | 47.5,80.75 66.5,80.75 | 66.5,80.75 66.5,90.25 | 66.5,80.75 85.5,80.75 | 85.5,80.75 85.5,90.25 | 85.5,80.75 104.5,80.75 | 104.5,80.75 104.5,90.25 | 209,80.75 190,80.75 190,90.22 D99.A 190,90.28 v190,95 | 209,80.75 209,90.22 D100.A | 209,80.75 228,80.75 | 228,80.75 228.03,80.78 D101.A | 228,80.75 247,80.75 | 247,80.75 247,90.22 D102.A | 247,80.75 266,80.75 266.03,80.78 D103.A | 104.5,80.75 123.5,80.75 v123.5,95
ROW2  (via drill 1)  (3 unrouted)
  Route7 0.076: v285,99.75 256.5,102.12 arc11 v28.5,99.75
  Bottom 1.27: D78.A 29.71,65.29 33.25,61.75 47.5,61.75 | 47.5,61.75 47.5,71.22 D77.A | 47.5,61.75 66.5,61.75 | 66.5,61.75 66.53,61.78 D76.A | 66.5,61.75 85.5,61.75 | 85.5,61.75 85.5,71.22 D75.A | 85.5,61.75 104.5,61.75 104.53,61.78 D74.A | D109.A 190,71.22 190,61.75 209,61.75 209.03,61.78 | 209.03,61.78 D108.A | 209.03,61.78 227.97,61.78 228,61.75 228.03,61.78 | 228.03,61.78 D107.A | 228.03,61.78 228.05,61.75 247,61.75 | 247,61.75 247,71.22 D106.A | 247,61.75 266,61.75 266.03,61.78 | 266.03,61.78 D105.A | 266.03,61.78 282.65,61.78 285,64.12 v285,99.75 | IC1.19 38.77,102.9 v28.5,99.75
ROW3  (via drill 1)  (3 unrouted)
  Route7 0.076: v287.38,99.75 275.5,102.12 arc24 v26.12,99.75
  Bottom 1.27: D88.A 29.71,46.29 33.25,42.75 47.5,42.75 | 47.5,42.75 47.53,42.78 D89.A | 47.5,42.75 66.5,42.75 | 66.5,42.75 66.5,52.22 D91.A | 66.5,42.75 85.5,42.75 85.53,42.78 | 85.53,42.78 D92.A | 85.53,42.78 85.55,42.75 104.5,42.75 104.5,52.22 D95.A | D118.A 190.03,42.78 190,42.75 209,42.75 | 209,42.75 209,52.22 D121.A | 209,42.75 228,42.75 | 228,42.75 228.03,42.78 D122.A | 228,42.75 247,42.75 | 247,42.75 247,52.22 D123.A | 247,42.75 266,42.75 266.03,42.78 | 266.03,42.78 D124.A | 266.03,42.78 285.03,42.78 287.38,45.12 v287.38,99.75 | v26.12,99.75 27.91,102.12 36.23,105.11 IC1.18
ROW4  (via drill 1)  (2 unrouted)
  Route7 0.076: v289.75,99.75 237.5,111.62 arc32 v23.75,99.75
  Bottom 1.27: D87.A 29.71,27.29 33.25,23.75 47.5,23.75 | 47.5,23.75 66.5,23.75 | 66.5,23.75 66.53,23.77 D90.A | 66.5,23.75 85.5,23.75 | 85.5,23.75 85.5,33.22 D93.A | 85.5,23.75 104.5,23.75 104.5,33.22 D94.A | D119.A 190.03,26.15 192.38,23.75 209,23.75 | 209,23.75 209.03,23.77 D120.A | 209,23.75 228,23.75 | 228,23.75 228.03,23.77 D126.A | 228,23.75 247,23.75 | 247,23.75 247,33.22 D125.A | v23.75,99.75 23.75,102.12 26.12,104.5 28.5,104.5 32.2,105.83 33.7,107.32 IC1.17 | 247,23.75 266,23.75 | 266,23.75 282.62,23.75 289.75,30.88 v289.75,99.75 | 266,23.75 266.03,23.77 D1.A | 47.5,23.75 47.53,23.77 D3.A
ROW5  (via drill 1)  (2 unrouted)
  Route7 0.076: v292.12,99.75 239.88,111.62 v21.38,99.75 arc-3 38.18,105.13
  Bottom 1.27: D83.A 29.71,8.29 33.25,4.75 47.5,4.75 | 47.5,4.75 47.5,14.22 D84.A | 47.5,4.75 66.5,4.75 66.53,4.78 | 66.53,4.78 D85.A | 95,14.22 D130.A 95.03,4.78 arc-90 95,4.75 66.55,4.75 arc-90 66.53,4.78 | D129.A 199.53,4.78 228.03,4.78 | 228.03,4.78 228,4.75 | 228.03,4.78 D112.A | 228.03,4.78 228.05,4.75 247,4.75 | 247,4.75 247,14.22 D113.A | 247,4.75 266,4.75 | 266,4.75 266.03,4.78 D114.A | v292.12,99.75 292.12,23.75 285,16.62 | 285.03,16.6 285,16.62 | 266,4.75 280.25,4.75 285,9.5 285,16.62 | IC1.15 22.31,107.81 21.38,106.88 v21.38,99.75
ROW6  (via drill 1)  (12 unrouted)
  Route7 0.076: v294.5,99.75 216.12,118.75 v19,99.75
  Bottom 1.27: 19,93.79 D45.A | D104.A 294.5,20.21 294.5,36.79 D127.A 294.5,39.21 294.5,55.79 D128.A 294.5,58.21 294.5,74.79 D2.A 294.5,77.21 294.5,93.79 D115.A 294.5,96.21 v294.5,99.75 | 19,74.79 D79.A | IC1.16 31.16,111.34 30.88,111.62 19,111.62 v19,99.75
ROW7  (via drill 1)
  Route7 0.076: v171,99.75 171,102.12 arc190 v142.5,99.75
  Bottom 1.27: D97.A 142.5,29.71 142.5,55.79 D96.A 142.5,58.21 142.5,74.79 D73.A 142.5,77.21 142.5,93.79 D72.A 142.5,96.21 v142.5,99.75 52.25,99.75 51.48,100.53 IC1.24 | D98.A 171,29.71 171,55.79 D110.A 171,58.21 171,74.79 D117.A 171,77.21 171,92.62 172.21,93.84 D116.A 171,96.21 v171,99.75
VCC  (via drill 1)
  Top 0.406: U1.VBUS1 84.42,119.83 85.5,118.75
  Top 1.27: C3.1 C4.1 C5.1 C6.1 C7.1 95.85,118.75 v90.25,118.75 85.5,118.75 85.5,115.42 R5.1 | IC1.20 41.31,105.34 v41.56,105.09 43.85,107.39 IC1.21
  Route7 0.076: v41.56,105.09 64.12,104.5 arc60 v90.25,118.75
  Bottom 1.27: IC1.7 46.4,112.89 45.12,111.62 | IC1.21 43.85,110.36 45.12,111.62 | IC1.20 41.31,110.19 42.75,111.62 45.12,111.62
(copper drawn outside any net)
  shapes: Top area x4